# EAGLE schematic mecha (EAGLE 9.6.2)
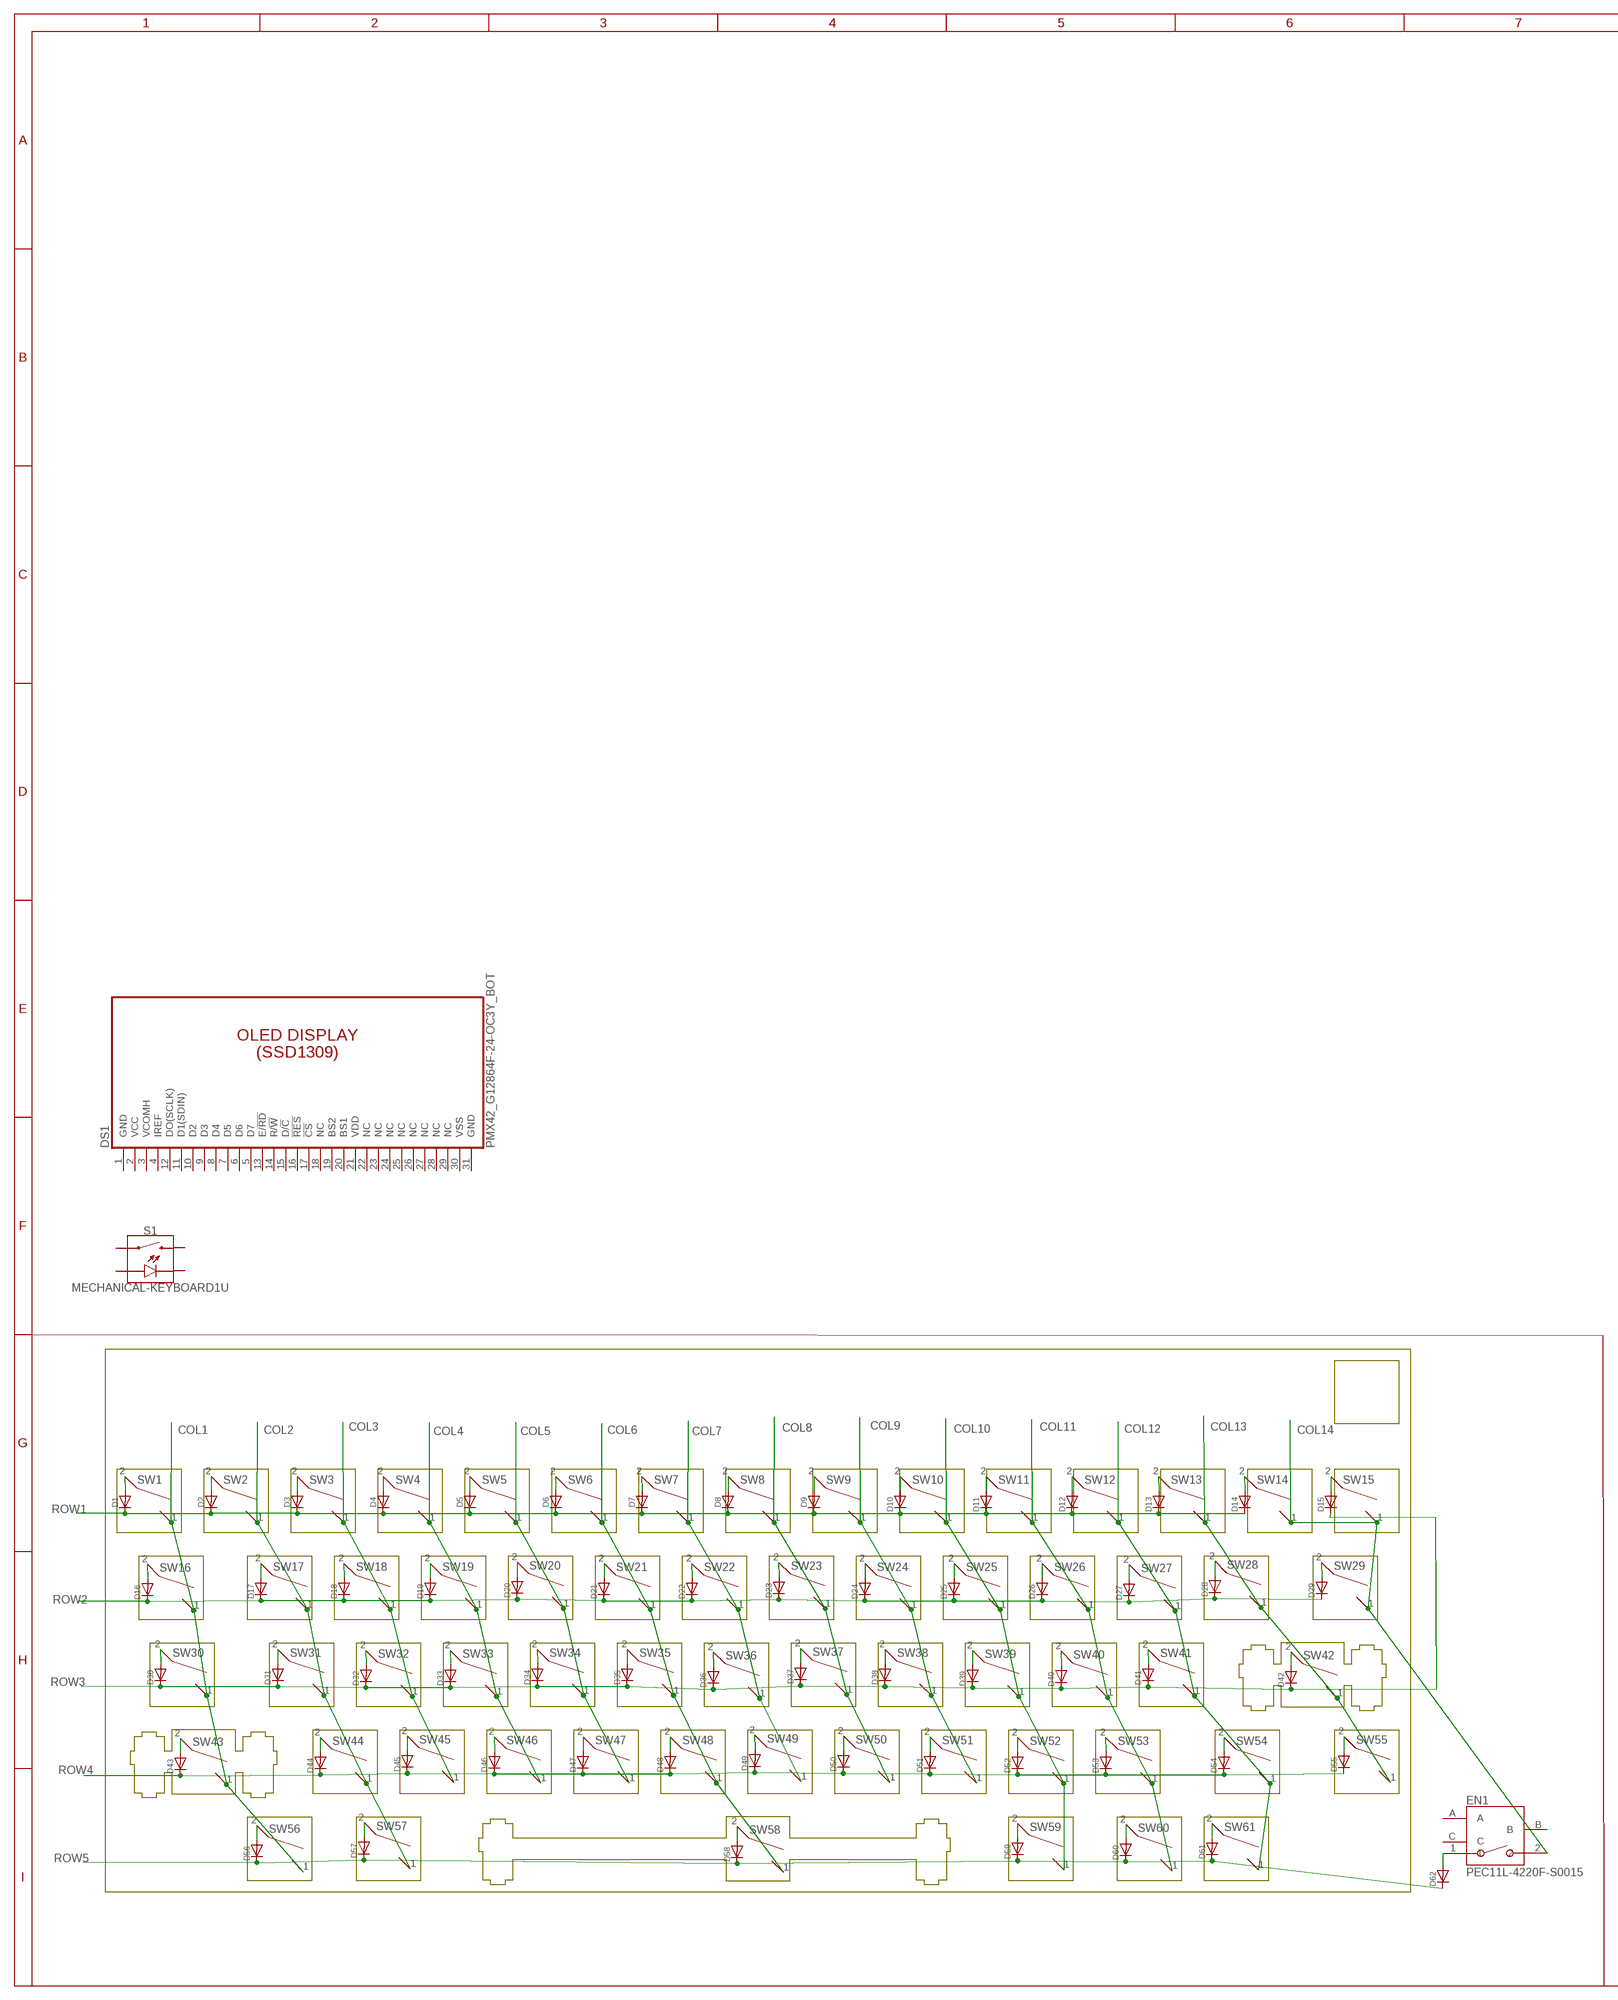
[diagram p0: schematic, sheet 1, part 1 of 2]
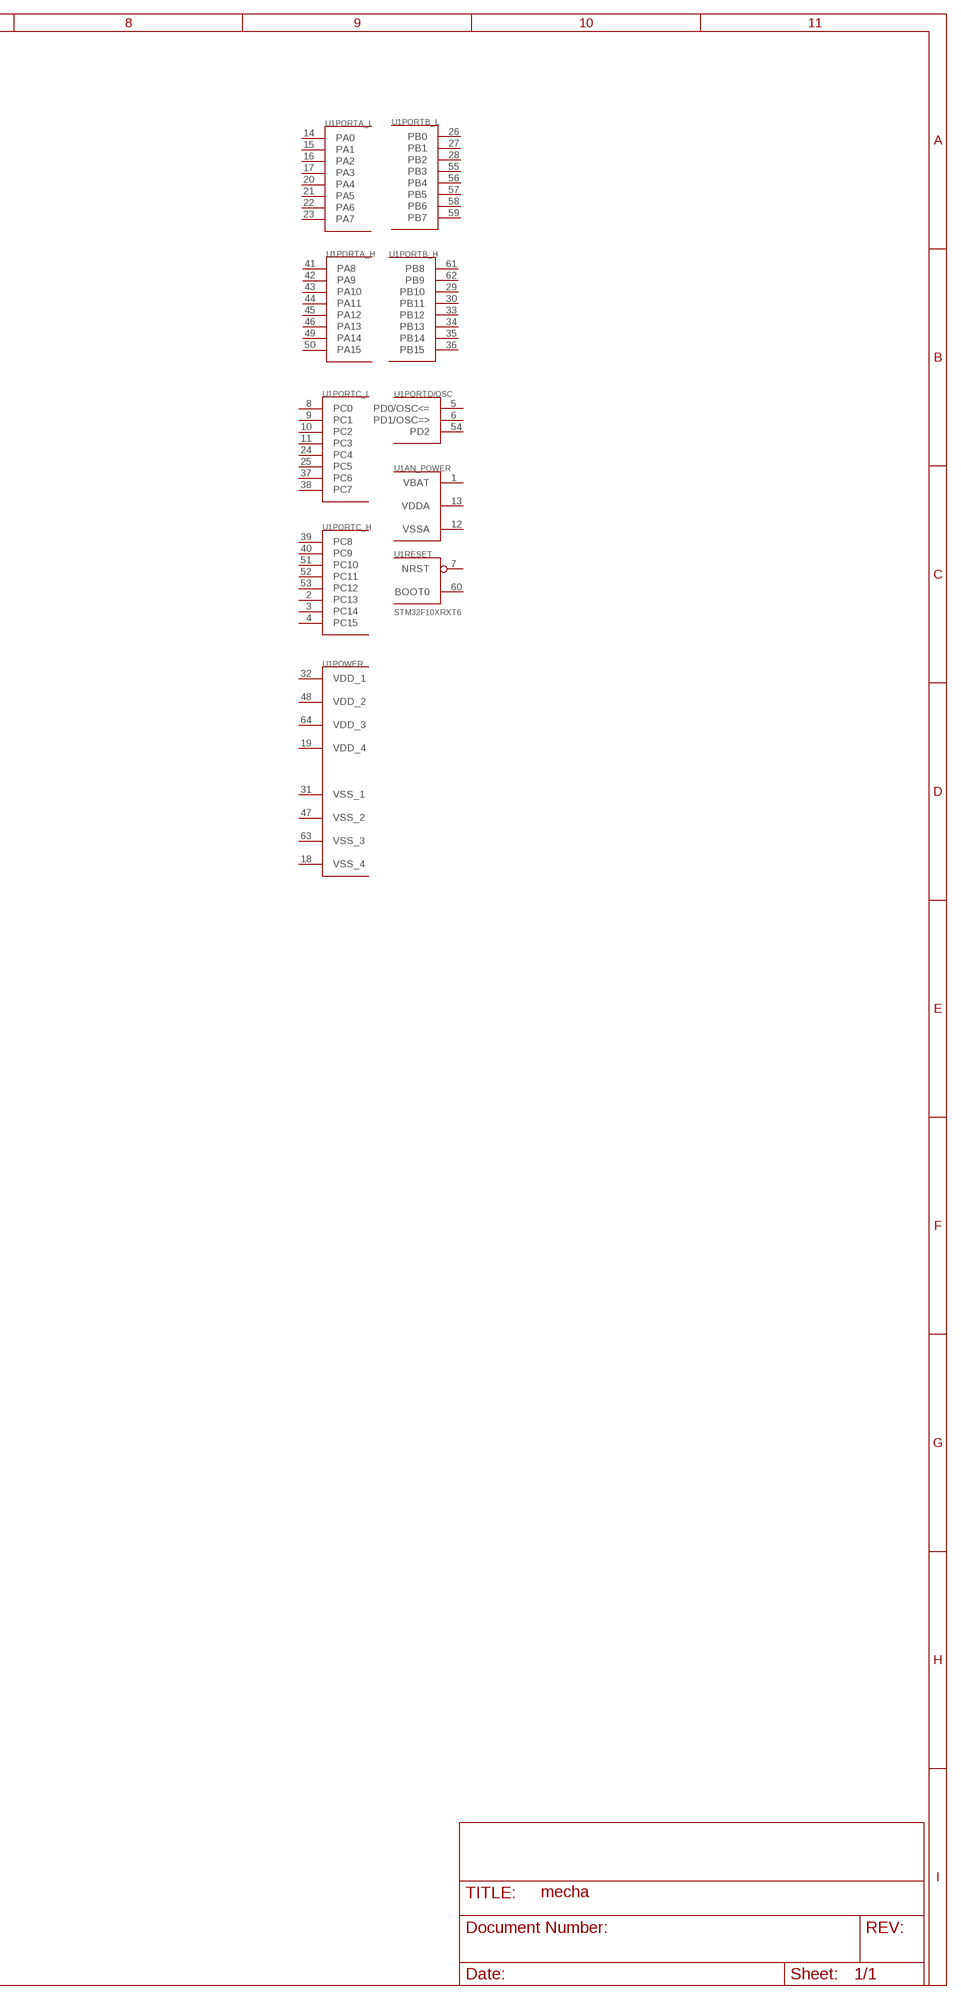
[diagram p1: schematic, sheet 1, part 2 of 2]

## Parts
D1  DIODESOD-323F  [SOD-323F]
D2  DIODESOD-323F  [SOD-323F]
D3  DIODESOD-323F  [SOD-323F]
D4  DIODESOD-323F  [SOD-323F]
D5  DIODESOD-323F  [SOD-323F]
D6  DIODESOD-323F  [SOD-323F]
D7  DIODESOD-323F  [SOD-323F]
D8  DIODESOD-323F  [SOD-323F]
D9  DIODESOD-323F  [SOD-323F]
D10  DIODESOD-323F  [SOD-323F]
D11  DIODESOD-323F  [SOD-323F]
D12  DIODESOD-323F  [SOD-323F]
D13  DIODESOD-323F  [SOD-323F]
D14  DIODESOD-323F  [SOD-323F]
D15  DIODESOD-323F  [SOD-323F]
D16  DIODESOD-323F  [SOD-323F]
D17  DIODESOD-323F  [SOD-323F]
D18  DIODESOD-323F  [SOD-323F]
D19  DIODESOD-323F  [SOD-323F]
D20  DIODESOD-323F  [SOD-323F]
D21  DIODESOD-323F  [SOD-323F]
D22  DIODESOD-323F  [SOD-323F]
D23  DIODESOD-323F  [SOD-323F]
D24  DIODESOD-323F  [SOD-323F]
D25  DIODESOD-323F  [SOD-323F]
D26  DIODESOD-323F  [SOD-323F]
D27  DIODESOD-323F  [SOD-323F]
D28  DIODESOD-323F  [SOD-323F]
D29  DIODESOD-323F  [SOD-323F]
D30  DIODESOD-323F  [SOD-323F]
D31  DIODESOD-323F  [SOD-323F]
D32  DIODESOD-323F  [SOD-323F]
D33  DIODESOD-323F  [SOD-323F]
D34  DIODESOD-323F  [SOD-323F]
D35  DIODESOD-323F  [SOD-323F]
D36  DIODESOD-323F  [SOD-323F]
D37  DIODESOD-323F  [SOD-323F]
D38  DIODESOD-323F  [SOD-323F]
D39  DIODESOD-323F  [SOD-323F]
D40  DIODESOD-323F  [SOD-323F]
D41  DIODESOD-323F  [SOD-323F]
D42  DIODESOD-323F  [SOD-323F]
D43  DIODESOD-323F  [SOD-323F]
D44  DIODESOD-323F  [SOD-323F]
D45  DIODESOD-323F  [SOD-323F]
D46  DIODESOD-323F  [SOD-323F]
D47  DIODESOD-323F  [SOD-323F]
D48  DIODESOD-323F  [SOD-323F]
D49  DIODESOD-323F  [SOD-323F]
D50  DIODESOD-323F  [SOD-323F]
D51  DIODESOD-323F  [SOD-323F]
D52  DIODESOD-323F  [SOD-323F]
D53  DIODESOD-323F  [SOD-323F]
D54  DIODESOD-323F  [SOD-323F]
D55  DIODESOD-323F  [SOD-323F]
D56  DIODESOD-323F  [SOD-323F]
D57  DIODESOD-323F  [SOD-323F]
D58  DIODESOD-323F  [SOD-323F]
D59  DIODESOD-323F  [SOD-323F]
D60  DIODESOD-323F  [SOD-323F]
D61  DIODESOD-323F  [SOD-323F]
D62  DIODESOD-323F  [SOD-323F]
DS1  PMX42_G12864F-24-OC3Y_BOT  [PMX42_G12864F-24-OC3Y_BOT]
EN1  PEC11L-4220F-S0015  [PEC11L-4220F-S0015]
S1  MECHANICAL-KEYBOARD1U  [CHERRY-MX-LED-1U]
SW1  KAILH_SWITCH_SOCKET  [SWITCH_SOCKET]
SW2  KAILH_SWITCH_SOCKET  [SWITCH_SOCKET]
SW3  KAILH_SWITCH_SOCKET  [SWITCH_SOCKET]
SW4  KAILH_SWITCH_SOCKET  [SWITCH_SOCKET]
SW5  KAILH_SWITCH_SOCKET  [SWITCH_SOCKET]
SW6  KAILH_SWITCH_SOCKET  [SWITCH_SOCKET]
SW7  KAILH_SWITCH_SOCKET  [SWITCH_SOCKET]
SW8  KAILH_SWITCH_SOCKET  [SWITCH_SOCKET]
SW9  KAILH_SWITCH_SOCKET  [SWITCH_SOCKET]
SW10  KAILH_SWITCH_SOCKET  [SWITCH_SOCKET]
SW11  KAILH_SWITCH_SOCKET  [SWITCH_SOCKET]
SW12  KAILH_SWITCH_SOCKET  [SWITCH_SOCKET]
SW13  KAILH_SWITCH_SOCKET  [SWITCH_SOCKET]
SW14  KAILH_SWITCH_SOCKET  [SWITCH_SOCKET]
SW15  KAILH_SWITCH_SOCKET  [SWITCH_SOCKET]
SW16  KAILH_SWITCH_SOCKET  [SWITCH_SOCKET]
SW17  KAILH_SWITCH_SOCKET  [SWITCH_SOCKET]
SW18  KAILH_SWITCH_SOCKET  [SWITCH_SOCKET]
SW19  KAILH_SWITCH_SOCKET  [SWITCH_SOCKET]
SW20  KAILH_SWITCH_SOCKET  [SWITCH_SOCKET]
SW21  KAILH_SWITCH_SOCKET  [SWITCH_SOCKET]
SW22  KAILH_SWITCH_SOCKET  [SWITCH_SOCKET]
SW23  KAILH_SWITCH_SOCKET  [SWITCH_SOCKET]
SW24  KAILH_SWITCH_SOCKET  [SWITCH_SOCKET]
SW25  KAILH_SWITCH_SOCKET  [SWITCH_SOCKET]
SW26  KAILH_SWITCH_SOCKET  [SWITCH_SOCKET]
SW27  KAILH_SWITCH_SOCKET  [SWITCH_SOCKET]
SW28  KAILH_SWITCH_SOCKET  [SWITCH_SOCKET]
SW29  KAILH_SWITCH_SOCKET  [SWITCH_SOCKET]
SW30  KAILH_SWITCH_SOCKET  [SWITCH_SOCKET]
SW31  KAILH_SWITCH_SOCKET  [SWITCH_SOCKET]
SW32  KAILH_SWITCH_SOCKET  [SWITCH_SOCKET]
SW33  KAILH_SWITCH_SOCKET  [SWITCH_SOCKET]
SW34  KAILH_SWITCH_SOCKET  [SWITCH_SOCKET]
SW35  KAILH_SWITCH_SOCKET  [SWITCH_SOCKET]
SW36  KAILH_SWITCH_SOCKET  [SWITCH_SOCKET]
SW37  KAILH_SWITCH_SOCKET  [SWITCH_SOCKET]
SW38  KAILH_SWITCH_SOCKET  [SWITCH_SOCKET]
SW39  KAILH_SWITCH_SOCKET  [SWITCH_SOCKET]
SW40  KAILH_SWITCH_SOCKET  [SWITCH_SOCKET]
SW41  KAILH_SWITCH_SOCKET  [SWITCH_SOCKET]
SW42  KAILH_SWITCH_SOCKET  [SWITCH_SOCKET]
SW43  KAILH_SWITCH_SOCKET  [SWITCH_SOCKET]
SW44  KAILH_SWITCH_SOCKET  [SWITCH_SOCKET]
SW45  KAILH_SWITCH_SOCKET  [SWITCH_SOCKET]
SW46  KAILH_SWITCH_SOCKET  [SWITCH_SOCKET]
SW47  KAILH_SWITCH_SOCKET  [SWITCH_SOCKET]
SW48  KAILH_SWITCH_SOCKET  [SWITCH_SOCKET]
SW49  KAILH_SWITCH_SOCKET  [SWITCH_SOCKET]
SW50  KAILH_SWITCH_SOCKET  [SWITCH_SOCKET]
SW51  KAILH_SWITCH_SOCKET  [SWITCH_SOCKET]
SW52  KAILH_SWITCH_SOCKET  [SWITCH_SOCKET]
SW53  KAILH_SWITCH_SOCKET  [SWITCH_SOCKET]
SW54  KAILH_SWITCH_SOCKET  [SWITCH_SOCKET]
SW55  KAILH_SWITCH_SOCKET  [SWITCH_SOCKET]
SW56  KAILH_SWITCH_SOCKET  [SWITCH_SOCKET]
SW57  KAILH_SWITCH_SOCKET  [SWITCH_SOCKET]
SW58  KAILH_SWITCH_SOCKET  [SWITCH_SOCKET]
SW59  KAILH_SWITCH_SOCKET  [SWITCH_SOCKET]
SW60  KAILH_SWITCH_SOCKET  [SWITCH_SOCKET]
SW61  KAILH_SWITCH_SOCKET  [SWITCH_SOCKET]
U1  STM32F10XRXT6  [TQFP64]

## Nets
COL1: SW1.1 SW16.1 SW30.1 SW43.1 SW56.1
COL2: SW2.1 SW17.1 SW31.1 SW44.1 SW57.1
COL3: SW3.1 SW18.1 SW32.1 SW45.1
COL4: SW4.1 SW19.1 SW33.1 SW46.1
COL5: SW5.1 SW20.1 SW34.1 SW47.1
COL6: SW6.1 SW21.1 SW35.1 SW48.1 SW58.1
COL7: SW7.1 SW22.1 SW36.1 SW49.1
COL8: SW8.1 SW23.1 SW37.1 SW50.1
COL9: SW9.1 SW24.1 SW38.1 SW51.1
COL10: SW10.1 SW25.1 SW39.1 SW52.1 SW59.1
COL11: SW11.1 SW26.1 SW40.1 SW53.1 SW60.1
COL12: SW12.1 SW27.1 SW41.1 SW54.1 SW61.1
COL13: SW13.1 SW28.1 SW42.1 SW55.1
COL14: EN1.2 SW14.1 SW15.1 SW29.1
N$1: D1.A SW1.2
N$2: D2.A SW2.2
N$3: D3.A SW3.2
N$4: D4.A SW4.2
N$5: D5.A SW5.2
N$6: D6.A SW6.2
N$7: D7.A SW7.2
N$8: D8.A SW8.2
N$9: D9.A SW9.2
N$10: D10.A SW10.2
N$11: D11.A SW11.2
N$12: D12.A SW12.2
N$13: D13.A SW13.2
N$14: D14.A SW14.2
N$15: D15.A SW15.2
N$16: D16.A SW16.2
N$17: D17.A SW17.2
N$18: D18.A SW18.2
N$19: D19.A SW19.2
N$20: D20.A SW20.2
N$21: D21.A SW21.2
N$22: D22.A SW22.2
N$23: D23.A SW23.2
N$24: D24.A SW24.2
N$25: D25.A SW25.2
N$26: D26.A SW26.2
N$27: D27.A SW27.2
N$28: D28.A SW28.2
N$29: D29.A SW29.2
N$30: D30.A SW30.2
N$31: D31.A SW31.2
N$32: D32.A SW32.2
N$33: D33.A SW33.2
N$34: D34.A SW34.2
N$35: D35.A SW35.2
N$36: D36.A SW36.2
N$37: D37.A SW37.2
N$38: D38.A SW38.2
N$39: D39.A SW39.2
N$40: D40.A SW40.2
N$41: D41.A SW41.2
N$42: D42.A SW42.2
N$43: D43.A SW43.2
N$44: D44.A SW44.2
N$45: D45.A SW45.2
N$46: D46.A SW46.2
N$47: D47.A SW47.2
N$48: D48.A SW48.2
N$49: D49.A SW49.2
N$50: D50.A SW50.2
N$51: D51.A SW51.2
N$52: D52.A SW52.2
N$53: D53.A SW53.2
N$54: D54.A SW54.2
N$55: D55.A SW55.2
N$56: D56.A SW56.2
N$57: D57.A SW57.2
N$58: D58.A SW58.2
N$59: D59.A SW59.2
N$60: D60.A SW60.2
N$61: D61.A SW61.2
N$67: D62.A EN1.1
ROW1: D1.C D2.C D3.C D4.C D5.C D6.C D7.C D8.C D9.C D10.C D11.C D12.C D13.C D14.C
ROW2: D16.C D17.C D18.C D19.C D20.C D21.C D22.C D23.C D24.C D25.C D26.C D27.C D28.C D29.C
ROW3: D15.C D30.C D31.C D32.C D33.C D34.C D35.C D36.C D37.C D38.C D39.C D40.C D41.C D42.C
ROW4: D43.C D44.C D45.C D46.C D47.C D48.C D49.C D50.C D51.C D52.C D53.C D54.C D55.C
ROW5: D56.C D57.C D58.C D59.C D60.C D61.C D62.C
Unconnected: DS1.3(VCOMH) DS1.4(IREF) DS1.5(D7) DS1.6(D6) DS1.7(D5) DS1.8(D4) DS1.9(D3) DS1.10(D2) DS1.11(D1(SDIN)) DS1.12(DO(SCLK)) DS1.13(E/!RD!) DS1.14(R/!W!) DS1.15(D/!C!) DS1.16(!RES!) DS1.17(!CS!) DS1.18(NC) DS1.19(BS2) DS1.20(BS1) DS1.22(NC) DS1.23(NC) DS1.24(NC) DS1.25(NC) DS1.26(NC) DS1.27(NC) DS1.28(NC) DS1.29(NC) EN1.A EN1.B EN1.C S1.A S1.K(C) S1.S1 S1.S2 U1.2(PORTC_H:PC13) U1.3(PORTC_H:PC14) U1.4(PORTC_H:PC15) U1.5(PORTD/OSC:PD0/OSC<=) U1.6(PORTD/OSC:PD1/OSC=>) U1.7(RESET:NRST) U1.8(PORTC_L:PC0) U1.9(PORTC_L:PC1) U1.10(PORTC_L:PC2) U1.11(PORTC_L:PC3) U1.14(PORTA_L:PA0) U1.15(PORTA_L:PA1) U1.16(PORTA_L:PA2) U1.17(PORTA_L:PA3) U1.20(PORTA_L:PA4) U1.21(PORTA_L:PA5) U1.22(PORTA_L:PA6) U1.23(PORTA_L:PA7) U1.24(PORTC_L:PC4) U1.25(PORTC_L:PC5) U1.26(PORTB_L:PB0) U1.27(PORTB_L:PB1) U1.28(PORTB_L:PB2) U1.29(PORTB_H:PB10) U1.30(PORTB_H:PB11) U1.33(PORTB_H:PB12) U1.34(PORTB_H:PB13) U1.35(PORTB_H:PB14) U1.36(PORTB_H:PB15) U1.37(PORTC_L:PC6) U1.38(PORTC_L:PC7) U1.39(PORTC_H:PC8) U1.40(PORTC_H:PC9) U1.41(PORTA_H:PA8) U1.42(PORTA_H:PA9) U1.43(PORTA_H:PA10) U1.44(PORTA_H:PA11) U1.45(PORTA_H:PA12) U1.46(PORTA_H:PA13) U1.49(PORTA_H:PA14) U1.50(PORTA_H:PA15) U1.51(PORTC_H:PC10) U1.52(PORTC_H:PC11) U1.53(PORTC_H:PC12) U1.54(PORTD/OSC:PD2) U1.55(PORTB_L:PB3) U1.56(PORTB_L:PB4) U1.57(PORTB_L:PB5) U1.58(PORTB_L:PB6) U1.59(PORTB_L:PB7) U1.60(RESET:BOOT0) U1.61(PORTB_H:PB8) U1.62(PORTB_H:PB9)

## Power pins joined to a net without a drawn wire
GND: DS1.1(GND) DS1.31(GND)
VBAT: U1.1(AN_POWER:VBAT)
VCC: DS1.2(VCC)
VDD: DS1.21(VDD)
VDD_1: U1.32(POWER:VDD_1)
VDD_2: U1.48(POWER:VDD_2)
VDD_3: U1.64(POWER:VDD_3)
VDD_4: U1.19(POWER:VDD_4)
VDDA: U1.13(AN_POWER:VDDA)
VSS: DS1.30(VSS)
VSS_1: U1.31(POWER:VSS_1)
VSS_2: U1.47(POWER:VSS_2)
VSS_3: U1.63(POWER:VSS_3)
VSS_4: U1.18(POWER:VSS_4)
VSSA: U1.12(AN_POWER:VSSA)

## Library data of the parts
D1-D62 = adafruit:DIODE: Diode SMADIODE - SMA Surface Mount Package 20V 1A Schottky Diode Digikey: 641-1014-6-ND DO-1N4148 - Through Hole Small Current Diode SOD-123 20V 1 A (.5mV Vf) Schottky Diode - Digikey: MBRX120TPMSCT-ND SOD-323 10V 570mA (.38mV Vf, 3ns) Schottky Diode - Digikey: ZLLS410CT-ND SOD-523 30V 30mA Schottky Diode (RB751S-40TE61) - Digikey: RB751S-40TE61CT-ND SOT23-R/W - SOT23 Package (R = Solder Paste/Reflow Ovens, W = Hand-Soldering) BAT54Film 40V 300mA - Digikey: 497-7162-1-ND
DS1 = 52101-101-REV-A_v16:PMX42_G12864F-24-OC3Y: OLED 128 x 64 DISPLAY FEMA Electronics
EN1 = Encoders:PEC11L-4220F-S0015: ROTARY ENCODER MECHANICAL 15PPR Manufacturer's datasheet <https://www.bourns.com/docs/Product-Datasheets/PEC11L.pdf>; CREATED_BY: PCBLayout.com; DIGIKEY_PARTNO: PEC11L-4220F-S0015-ND; MANUFACTURER: Bourns Inc.; MPN: PEC11L-4220F-S0015
S1 = SparkFun-Switches:MECHANICAL-KEYBOARD: Mechanical Keyboard Spacings for Cherry-MX Cherry-MX w/ LED switch footprints. Each package variant contains a bounding box on the tDocu layer for proper key spacing and a dimensional drawing on the Reference layer to be exported for laser cut mounting plates. Footprints are off-center so that the origin lies on the lower left corner of the key-spacing. This allows for most common layouts to be easily acheived on a grid spacing of 0.1875" Variants 1U through 1.75U in .25U steps Centered switch cutout in SwitchPlate layer with no stabilizers 2U through 2.75U in .25U steps Centered switch cutout in SwitchPlate layer with Cherry+Costar stabilizer holes 6.25U Common spacebar size Centered switch cutout in SwitchPlate layer with Cherry+Costar stabilizer holes "Big Ass" Enter ANSI 104 "Big Ass" Enter Key layout ISO Enter ISO style Enter Key layout
SW1-SW61 = Kailh_switch_socket:KAILH_SWITCH_SOCKET
U1 = stm32:STM32F10XRXT6: STM32F101/103 64pin LQFP